# Altium schematic sheet SHEET1.SCHDOC
size A2
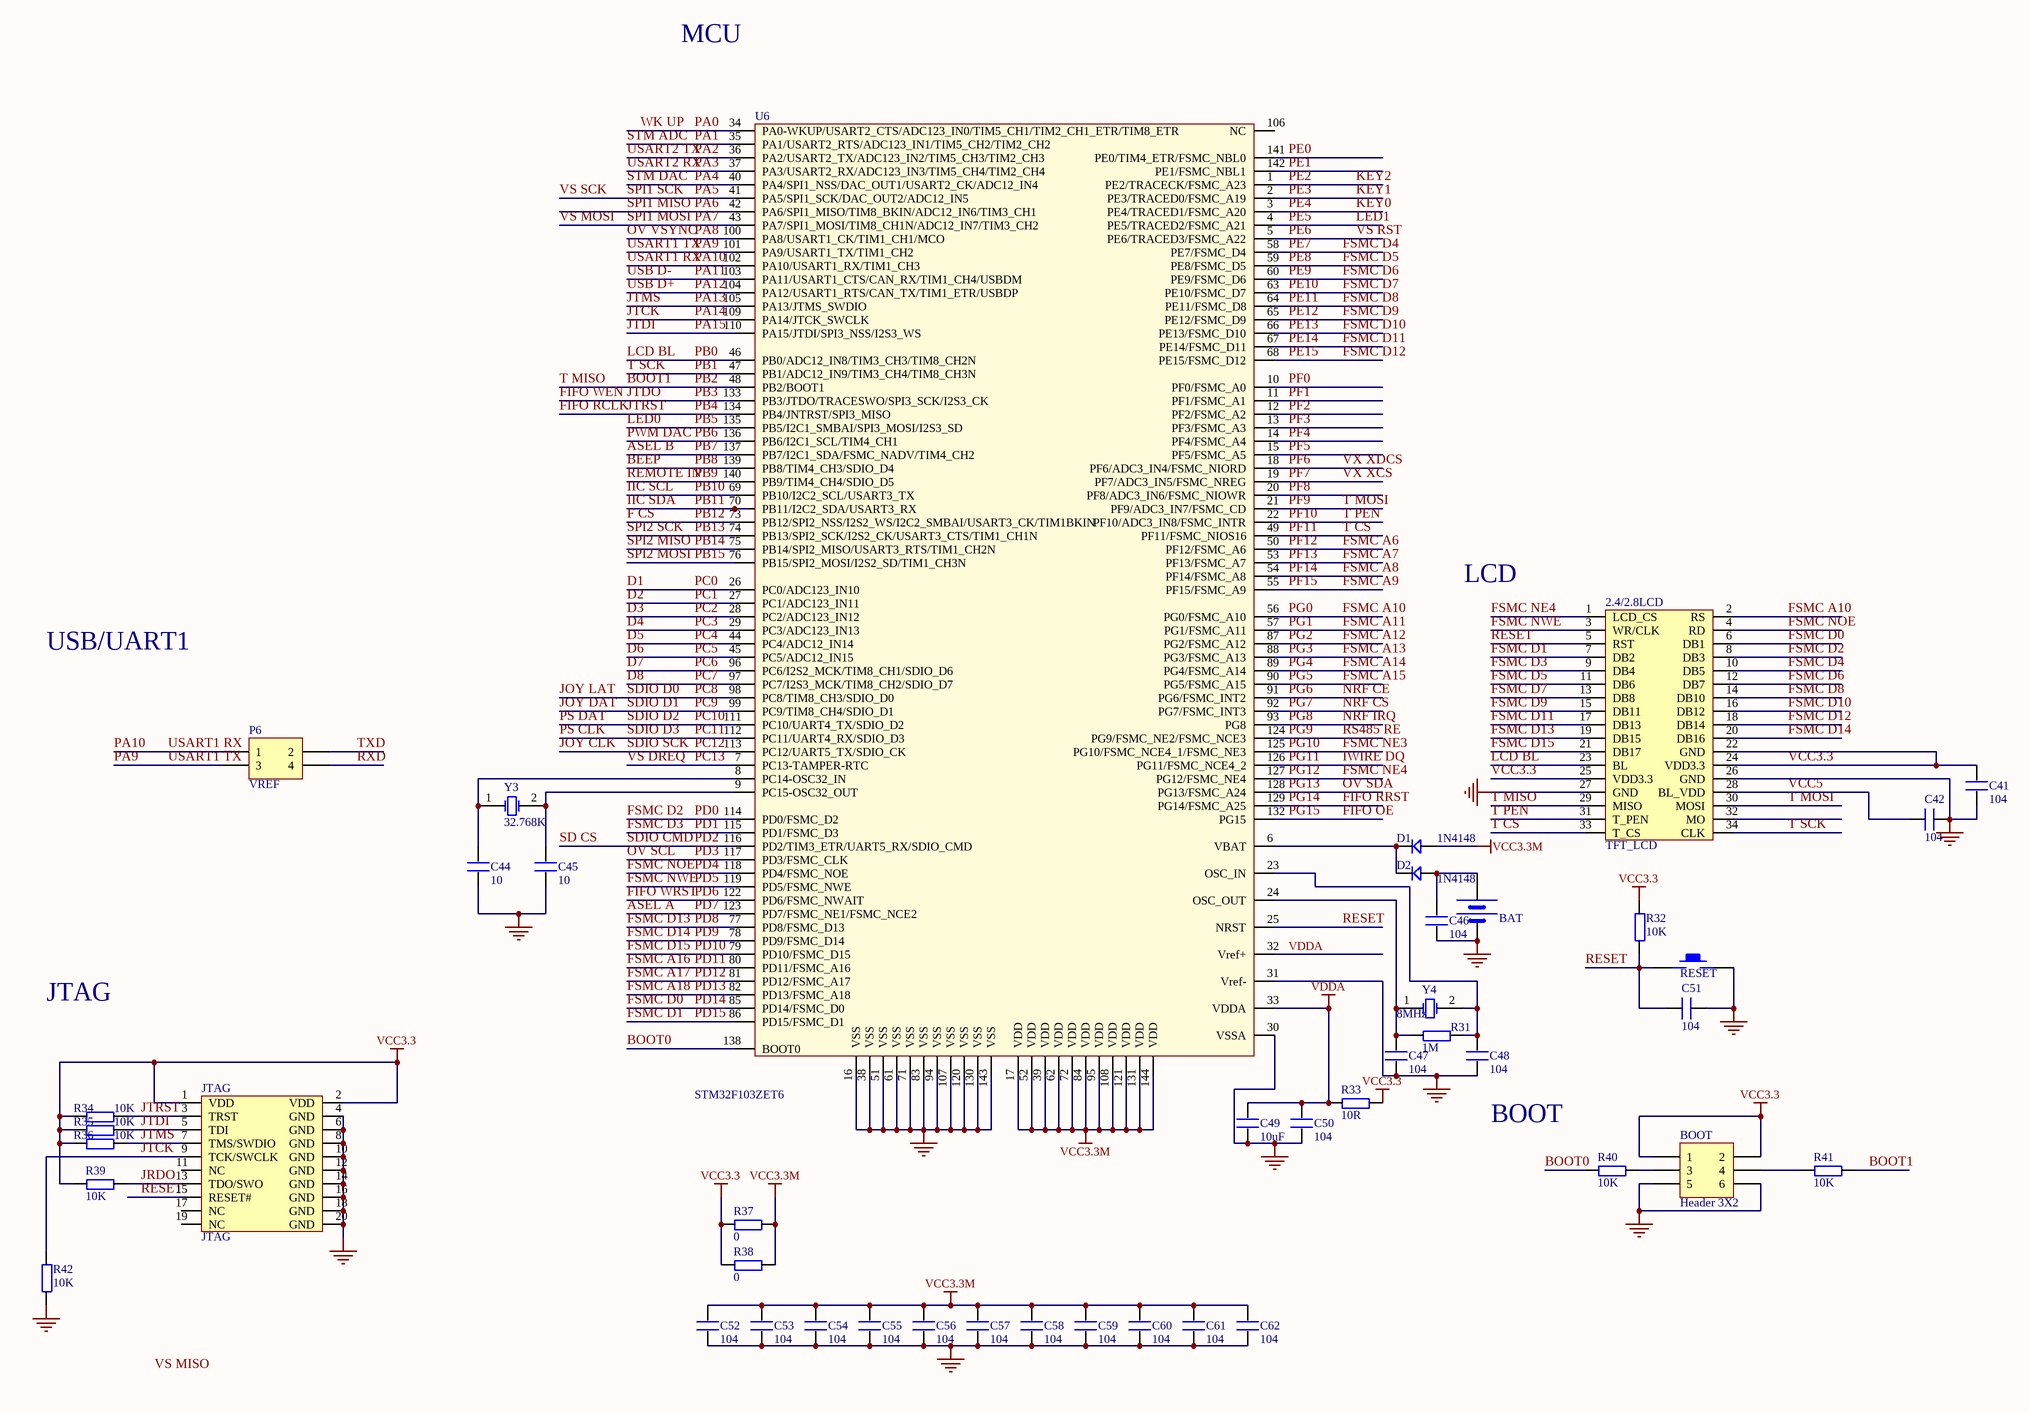
[diagram p0: SHEET1.SCHDOC]

## Parts
2.4/2.8LCD  TFT_LCD  [DB2*17]
BAT  BATT  [BATM]  (value not drawn)
BOOT  Header 3X2  [HDR2X3]
C41  104  [0603P]
C42  104  [0603P]
C44  10  [0603P]
C45  10  [0603P]
C46  104  [0603P]
C47  104  [0603P]
C48  104  [0603P]
C49  10uF  [0603P]
C50  104  [0603P]
C51  104  [0603P]
C52  104  [0603P]
C53  104  [0603P]
C54  104  [0603P]
C55  104  [0603P]
C56  104  [0603P]
C57  104  [0603P]
C58  104  [0603P]
C59  104  [0603P]
C60  104  [0603P]
C61  104  [0603P]
C62  104  [0603P]
D1  1N4148  [DIODE_SOP]
D2  1N4148  [DIODE_SOP]
JTAG  JTAG  [JTAG_20]
P6  VREF  [HDR2X2]
R31  1M  [0603P]
R32  10K  [0603P]
R33  10R  [0603P]
R34  10K  [0603P]
R35  10K  [0603P]
R36  10K  [0603P]
R37  0  [0603P]
R38  0  [0603P]
R39  10K  [0603P]
R40  10K  [0603P]
R41  10K  [0603P]
R42  10K  [0603P]
RESET  KEY_M  [KEY_M]  (value not drawn)
U6  STM32F103ZET6  [LQFP144]
Y3  32.768K  [XTAL32]
Y4  8MHz  [XTAL_US]

## Nets
GND: 2.4/2.8LCD.26(GND) 2.4/2.8LCD.27(GND) BAT.2(GND) BOOT.5 BOOT.6 C41.1 C42.1 C44.1 C45.1 C46.1 C47.1 C48.1 C49.1 C50.1 C51.1 C52.2 C53.2 C54.2 C55.2 C56.2 C57.2 C58.2 C59.2 C60.2 C61.2 C62.2 JTAG.4(GND) JTAG.6(GND) JTAG.8(GND) JTAG.10(GND) JTAG.12(GND) JTAG.14(GND) JTAG.16(GND) JTAG.18(GND) JTAG.20(GND) R42.1 RESET.2 U6.16(VSS) U6.30(VSSA) U6.31(Vref-) U6.38(VSS) U6.51(VSS) U6.61(VSS) U6.71(VSS) U6.83(VSS) U6.94(VSS) U6.107(VSS) U6.120(VSS) U6.130(VSS) U6.143(VSS)
VCC3.3: 2.4/2.8LCD.22(GND) 2.4/2.8LCD.24(VDD3.3) 2.4/2.8LCD.25(VDD3.3) BOOT.1 BOOT.2 C41.2 JTAG.1(VDD) JTAG.2(VDD) R32.2 R33.2 R34.1 R35.1 R36.1 R37.1 R38.1 R39.1
VCC3.3M: C52.1 C53.1 C54.1 C55.1 C56.1 C57.1 C58.1 C59.1 C60.1 C61.1 C62.1 D1.1 R37.2 R38.2 U6.17(VDD) U6.39(VDD) U6.52(VDD) U6.62(VDD) U6.72(VDD) U6.84(VDD) U6.95(VDD) U6.108(VDD) U6.121(VDD) U6.131(VDD) U6.144(VDD)
VDDA: C49.2 C50.2 R33.1 U6.32(Vref+) U6.33(VDDA)
ASEL A: U6.123(PD7/FSMC_NE1/FSMC_NCE2)  [also labelled PD7]
ASEL B: U6.137(PB7/I2C1_SDA/FSMC_NADV/TIM4_CH2)  [also labelled PB7]
BEEP: U6.139(PB8/TIM4_CH3/SDIO_D4)  [also labelled PB8]
BOOT0: R40.1 U6.138(BOOT0)
BOOT1: 2.4/2.8LCD.29(MISO) R41.2 U6.48(PB2/BOOT1)  [also labelled PB2, T MISO]
D1: U6.26(PC0/ADC123_IN10)  [also labelled PC0]
D2: U6.27(PC1/ADC123_IN11)  [also labelled PC1]
D3: U6.28(PC2/ADC123_IN12)  [also labelled PC2]
D4: U6.29(PC3/ADC123_IN13)  [also labelled PC3]
D5: U6.44(PC4/ADC12_IN14)  [also labelled PC4]
D6: U6.45(PC5/ADC12_IN15)  [also labelled PC5]
D7: U6.96(PC6/I2S2_MCK/TIM8_CH1/SDIO_D6)  [also labelled PC6]
D8: U6.97(PC7/I2S3_MCK/TIM8_CH2/SDIO_D7)  [also labelled PC7]
F CS: U6.73(PB12/SPI2_NSS/I2S2_WS/I2C2_SMBAI/USART3_CK/TIM1BKIN)  [also labelled PB12]
FIFO OE: U6.132(PG15)  [also labelled PG15]
FIFO RCLK: JTAG.3(TRST) R34.2 U6.134(PB4/JNTRST/SPI3_MISO)  [also labelled JTRST, PB4]
FIFO RRST: U6.129(PG14/FSMC_A25)  [also labelled PG14]
FIFO WEN: U6.133(PB3/JTDO/TRACESWO/SPI3_SCK/I2S3_CK)  [also labelled JTDO, PB3]
FIFO WRST: U6.122(PD6/FSMC_NWAIT)  [also labelled PD6]
FSMC A6: U6.50(PF12/FSMC_A6)  [also labelled PF12]
FSMC A7: U6.53(PF13/FSMC_A7)  [also labelled PF13]
FSMC A8: U6.54(PF14/FSMC_A8)  [also labelled PF14]
FSMC A9: U6.55(PF15/FSMC_A9)  [also labelled PF15]
FSMC A10: 2.4/2.8LCD.2(RS) U6.56(PG0/FSMC_A10)  [also labelled PG0]
FSMC A11: U6.57(PG1/FSMC_A11)  [also labelled PG1]
FSMC A12: U6.87(PG2/FSMC_A12)  [also labelled PG2]
FSMC A13: U6.88(PG3/FSMC_A13)  [also labelled PG3]
FSMC A14: U6.89(PG4/FSMC_A14)  [also labelled PG4]
FSMC A15: U6.90(PG5/FSMC_A15)  [also labelled PG5]
FSMC A16: U6.80(PD11/FSMC_A16)  [also labelled PD11]
FSMC A17: U6.81(PD12/FSMC_A17)  [also labelled PD12]
FSMC A18: U6.82(PD13/FSMC_A18)  [also labelled PD13]
FSMC D0: 2.4/2.8LCD.6(DB1) U6.85(PD14/FSMC_D0)  [also labelled PD14]
FSMC D1: 2.4/2.8LCD.7(DB2) U6.86(PD15/FSMC_D1)  [also labelled PD15]
FSMC D2: 2.4/2.8LCD.8(DB3) U6.114(PD0/FSMC_D2)  [also labelled PD0]
FSMC D3: 2.4/2.8LCD.9(DB4) U6.115(PD1/FSMC_D3)  [also labelled PD1]
FSMC D4: 2.4/2.8LCD.10(DB5) U6.58(PE7/FSMC_D4)  [also labelled PE7]
FSMC D5: 2.4/2.8LCD.11(DB6) U6.59(PE8/FSMC_D5)  [also labelled PE8]
FSMC D6: 2.4/2.8LCD.12(DB7) U6.60(PE9/FSMC_D6)  [also labelled PE9]
FSMC D7: 2.4/2.8LCD.13(DB8) U6.63(PE10/FSMC_D7)  [also labelled PE10]
FSMC D8: 2.4/2.8LCD.14(DB10) U6.64(PE11/FSMC_D8)  [also labelled PE11]
FSMC D9: 2.4/2.8LCD.15(DB11) U6.65(PE12/FSMC_D9)  [also labelled PE12]
FSMC D10: 2.4/2.8LCD.16(DB12) U6.66(PE13/FSMC_D10)  [also labelled PE13]
FSMC D11: 2.4/2.8LCD.17(DB13) U6.67(PE14/FSMC_D11)  [also labelled PE14]
FSMC D12: 2.4/2.8LCD.18(DB14) U6.68(PE15/FSMC_D12)  [also labelled PE15]
FSMC D13: 2.4/2.8LCD.19(DB15) U6.77(PD8/FSMC_D13)  [also labelled PD8]
FSMC D14: 2.4/2.8LCD.20(DB16) U6.78(PD9/FSMC_D14)  [also labelled PD9]
FSMC D15: 2.4/2.8LCD.21(DB17) U6.79(PD10/FSMC_D15)  [also labelled PD10]
FSMC NE3: U6.125(PG10/FSMC_NCE4_1/FSMC_NE3)  [also labelled PG10]
FSMC NE4: 2.4/2.8LCD.1(LCD_CS) U6.127(PG12/FSMC_NE4)  [also labelled PG12]
FSMC NOE: 2.4/2.8LCD.4(RD) U6.118(PD4/FSMC_NOE)  [also labelled PD4]
FSMC NWE: 2.4/2.8LCD.3(WR/CLK) U6.119(PD5/FSMC_NWE)  [also labelled PD5]
IIC SCL: U6.69(PB10/I2C2_SCL/USART3_TX)  [also labelled PB10]
IIC SDA: U6.70(PB11/I2C2_SDA/USART3_RX)  [also labelled PB11]
IWIRE DQ: U6.126(PG11/FSMC_NCE4_2)  [also labelled PG11]
JOY CLK: U6.113(PC12/UART5_TX/SDIO_CK)  [also labelled PC12, SDIO SCK]
JOY DAT: U6.99(PC9/TIM8_CH4/SDIO_D1)  [also labelled PC9, SDIO D1]
JOY LAT: U6.98(PC8/TIM8_CH3/SDIO_D0)  [also labelled PC8, SDIO D0]
JRDO: JTAG.13(TDO/SWO) R39.2
JTCK: JTAG.9(TCK/SWCLK) R42.2 U6.109(PA14/JTCK_SWCLK)  [also labelled PA14]
JTDI: JTAG.5(TDI) R35.2 U6.110(PA15/JTDI/SPI3_NSS/I2S3_WS)  [also labelled PA15]
JTMS: JTAG.7(TMS/SWDIO) R36.2 U6.105(PA13/JTMS_SWDIO)  [also labelled PA13]
KEY0: U6.3(PE4/TRACED1/FSMC_A20)  [also labelled PE4]
KEY1: U6.2(PE3/TRACED0/FSMC_A19)  [also labelled PE3]
KEY2: U6.1(PE2/TRACECK/FSMC_A23)  [also labelled PE2]
LCD BL: 2.4/2.8LCD.23(BL) U6.46(PB0/ADC12_IN8/TIM3_CH3/TIM8_CH2N)  [also labelled PB0]
LED0: U6.135(PB5/I2C1_SMBAI/SPI3_MOSI/I2S3_SD)  [also labelled PB5]
LED1: U6.4(PE5/TRACED2/FSMC_A21)  [also labelled PE5]
NRF CE: U6.91(PG6/FSMC_INT2)  [also labelled PG6]
NRF CS: U6.92(PG7/FSMC_INT3)  [also labelled PG7]
NRF IRQ: U6.93(PG8)  [also labelled PG8]
OV SCL: U6.117(PD3/FSMC_CLK)  [also labelled PD3]
OV SDA: U6.128(PG13/FSMC_A24)  [also labelled PG13]
OV VSYNC: U6.100(PA8/USART1_CK/TIM1_CH1/MCO)  [also labelled PA8]
PA0: U6.34(PA0-WKUP/USART2_CTS/ADC123_IN0/TIM5_CH1/TIM2_CH1_ETR/TIM8_ETR)  [also labelled WK UP]
PA1: U6.35(PA1/USART2_RTS/ADC123_IN1/TIM5_CH2/TIM2_CH2)  [also labelled STM ADC]
PA2: U6.36(PA2/USART2_TX/ADC123_IN2/TIM5_CH3/TIM2_CH3)  [also labelled USART2 TX]
PA3: U6.37(PA3/USART2_RX/ADC123_IN3/TIM5_CH4/TIM2_CH4)  [also labelled USART2 RX]
PA4: U6.40(PA4/SPI1_NSS/DAC_OUT1/USART2_CK/ADC12_IN4)  [also labelled STM DAC]
PA5: U6.41(PA5/SPI1_SCK/DAC_OUT2/ADC12_IN5)  [also labelled SPI1 SCK, VS SCK]
PA6: U6.42(PA6/SPI1_MISO/TIM8_BKIN/ADC12_IN6/TIM3_CH1)  [also labelled SPI1 MISO]
PA7: U6.43(PA7/SPI1_MOSI/TIM8_CH1N/ADC12_IN7/TIM3_CH2)  [also labelled SPI1 MOSI, VS MOSI]
PA9: P6.3 U6.101(PA9/USART1_TX/TIM1_CH2)  [also labelled USART1 TX]
PA10: P6.1 U6.102(PA10/USART1_RX/TIM1_CH3)  [also labelled USART1 RX]
PA11: U6.103(PA11/USART1_CTS/CAN_RX/TIM1_CH4/USBDM)  [also labelled USB D-]
PA12: U6.104(PA12/USART1_RTS/CAN_TX/TIM1_ETR/USBDP)  [also labelled USB D+]
PB1: 2.4/2.8LCD.34(CLK) U6.47(PB1/ADC12_IN9/TIM3_CH4/TIM8_CH3N)  [also labelled T SCK]
PB6: U6.136(PB6/I2C1_SCL/TIM4_CH1)  [also labelled PWM DAC]
PB9: U6.140(PB9/TIM4_CH4/SDIO_D5)  [also labelled REMOTE IN]
PB13: U6.74(PB13/SPI2_SCK/I2S2_CK/USART3_CTS/TIM1_CH1N)  [also labelled SPI2 SCK]
PB14: U6.75(PB14/SPI2_MISO/USART3_RTS/TIM1_CH2N)  [also labelled SPI2 MISO]
PB15: U6.76(PB15/SPI2_MOSI/I2S2_SD/TIM1_CH3N)  [also labelled SPI2 MOSI]
PC10: U6.111(PC10/UART4_TX/SDIO_D2)  [also labelled PS DAT, SDIO D2]
PC11: U6.112(PC11/UART4_RX/SDIO_D3)  [also labelled PS CLK, SDIO D3]
PC13: U6.7(PC13-TAMPER-RTC)  [also labelled VS DREQ]
PD2: U6.116(PD2/TIM3_ETR/UART5_RX/SDIO_CMD)  [also labelled SD CS, SDIO CMD]
PE0: U6.141(PE0/TIM4_ETR/FSMC_NBL0)
PE1: U6.142(PE1/FSMC_NBL1)
PE6: U6.5(PE6/TRACED3/FSMC_A22)  [also labelled VS RST]
PF0: U6.10(PF0/FSMC_A0)
PF1: U6.11(PF1/FSMC_A1)
PF2: U6.12(PF2/FSMC_A2)
PF3: U6.13(PF3/FSMC_A3)
PF4: U6.14(PF4/FSMC_A4)
PF5: U6.15(PF5/FSMC_A5)
PF6: U6.18(PF6/ADC3_IN4/FSMC_NIORD)  [also labelled VX XDCS]
PF7: U6.19(PF7/ADC3_IN5/FSMC_NREG)  [also labelled VX XCS]
PF8: U6.20(PF8/ADC3_IN6/FSMC_NIOWR)
PF9: 2.4/2.8LCD.30(MOSI) U6.21(PF9/ADC3_IN7/FSMC_CD)  [also labelled T MOSI]
PF10: 2.4/2.8LCD.31(T_PEN) U6.22(PF10/ADC3_IN8/FSMC_INTR)  [also labelled T PEN]
PF11: 2.4/2.8LCD.33(T_CS) U6.49(PF11/FSMC_NIOS16)  [also labelled T CS]
PG9: U6.124(PG9/FSMC_NE2/FSMC_NCE3)  [also labelled RS485 RE]
RESET: 2.4/2.8LCD.5(RST) C51.2 JTAG.15(RESET#) R32.1 RESET.1 U6.25(NRST)
RXD: P6.4
TXD: P6.2
VCC5: 2.4/2.8LCD.28(BL_VDD) C42.2
NetBAT_1: BAT.1(VCC) C46.2 D2.1
NetBOOT_3: BOOT.3 R40.2
NetBOOT_4: BOOT.4 R41.1
NetC44_2: C44.2 U6.8(PC14-OSC32_IN) Y3.1(OSC1)
NetC45_2: C45.2 U6.9(PC15-OSC32_OUT) Y3.2(OSC2)
NetC47_2: C47.2 R31.1 U6.24(OSC_OUT) Y4.1(OSC1)
NetC48_2: C48.2 R31.2 U6.23(OSC_IN) Y4.2(OSC2)
NetD1_2: D1.2 D2.2 U6.6(VBAT)

Not connected (* = marked no-connect by the designer): 2.4/2.8LCD 32(MO); JTAG 11(NC) 17(NC) 19(NC); U6 106(NC)

## Notes on the sheet
- MCU
- LCD
- USB/UART1
- JTAG
- (near C48) BOOT
- Labels drawn without touching a wire or pin: VS MISO

## Library data of the parts
BAT = BAT
BOOT = Header 3X2: Header, 3-Pin, Dual row; LatestRevisionDate: 17-Jul-2002; LatestRevisionNote: Re-released for DXP Platform.; Publisher: Altium Limited
C41 C42 C44-C62 = C
D1 D2 = D
P6 = Header 2X2: Header, 2-Pin, Dual row; LatestRevisionDate: 17-Jul-2002; LatestRevisionNote: Re-released for DXP Platform.; Publisher: Altium Limited
R31-R42 = R
Y3 = XTAL_1: Crystal Oscillator; Published: 8-Jun-2000; LatestRevisionDate: 17-Jul-2002; LatestRevisionNote: Re-released for DXP Platform.; Publisher: Altium Limited
Y4 = XTAL: Crystal Oscillator; Published: 8-Jun-2000; LatestRevisionDate: 17-Jul-2002; LatestRevisionNote: Re-released for DXP Platform.; Publisher: Altium Limited